# Altium schematic sheet 7_SD_slot.SchDoc
size A4; SheetNumber: 8; SheetTotal: 13
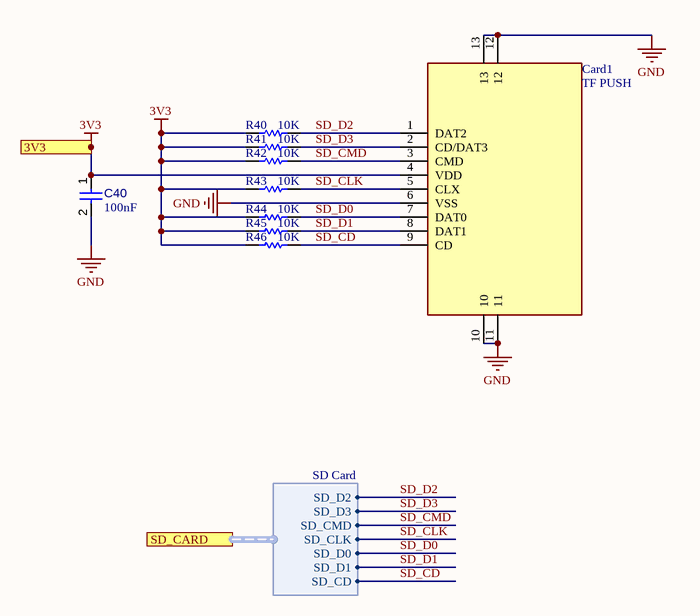
[diagram p0: 7_SD_slot.SchDoc]

## Parts
C40  value 100nF  [CAPC1608X90X40NL10T20]  (hidden comment: Capacitor 100 nF +/-10% 50 V 0603)
Card1  TF PUSH  [TF-SMD_TF-PUSH]
R40  10K  [RESC1609X55X30NL10T20]
R41  10K  [RESC1609X55X30NL10T20]
R42  10K  [RESC1609X55X30NL10T20]
R43  10K  [RESC1609X55X30NL10T20]
R44  10K  [RESC1609X55X30NL10T20]
R45  10K  [RESC1609X55X30NL10T20]
R46  10K  [RESC1609X55X30NL10T20]

## Ports
3V3, SD_CARD (harness SD Card)

## Harnesses
SD Card: SD_D2, SD_D3, SD_CMD, SD_CLK, SD_D0, SD_D1, SD_CD

## Nets
3V3: C40.1 Card1.4(VDD) R40.2 R41.2 R42.2 R43.2 R44.2 R45.2 R46.2 ; port 3V3
GND: C40.2 Card1.6(VSS) Card1.10 Card1.11 Card1.12 Card1.13
SD_CD: Card1.9(CD) R46.1 ; port SD_CARD.SD_CD
SD_CLK: Card1.5(CLX) R43.1 ; port SD_CARD.SD_CLK
SD_CMD: Card1.3(CMD) R42.1 ; port SD_CARD.SD_CMD
SD_D0: Card1.7(DAT0) R44.1 ; port SD_CARD.SD_D0
SD_D1: Card1.8(DAT1) R45.1 ; port SD_CARD.SD_D1
SD_D2: Card1.1(DAT2) R40.1 ; port SD_CARD.SD_D2
SD_D3: Card1.2(CD/DAT3) R41.1 ; port SD_CARD.SD_D3

## Notes on the sheet
- Date:
- A4
- Project:
- Time:
- Sheet
- of
- Revision:
- File:
- Drawn By:

## Library data of the parts
C40 = CMP-001-00017-6: Chip Capacitor, 100 nF, +/- 10%, 50 V, 0603 (1608 Metric); Voltage Rating: 50V; Capacitor Type: Ceramic; Tolerance: 10%; Mounting Technology: SM; Max Operating Temperature: 125°C; RoHS Compliant: True; Pins: 2; Case/Package: 0603; Min Operating Temperature: -55°C
Card1 = CMP-019-000000-1: Card Connection Mode:Push-Push Card Type:MicroSD Card (TF Card) Connector Type:Connector and Ejector Additional Card Detection Pins:No Supplementary Features:- Height Above Board:2mm Operating Temperature:-25℃~+90℃ Operating Temperature:-25℃~+90℃; Manufacturer: SHOU HAN(首韩); Additional Card Detection Pins: No; Source: EasyEDA.schlib; LCSC Part Name: 9P，自弹式TF卡座; Card Connection Mode: Push-Push; Manufacturer Part: TF PUSH; JLCPCB Part Class: Extended Part; Operating Temperature: -25℃~+90℃; Datasheet: https://item.szlcsc.com/datasheet/TF%2520PUSH/372553.html; Design Item ID: TF PUSH; Supplier Part: C393941; Connector Type: Connector and Ejector; Height Above Board: 2mm; Supplier Footprint: SMD; Card Type: MicroSD Card (TF Card)
R40-R46 = CMP-2000-03692-1: Manufacturer: Vishay Dale; Part Number: TNPW060310K0BEEN